# EAGLE schematic mute (EAGLE 7.2.0)
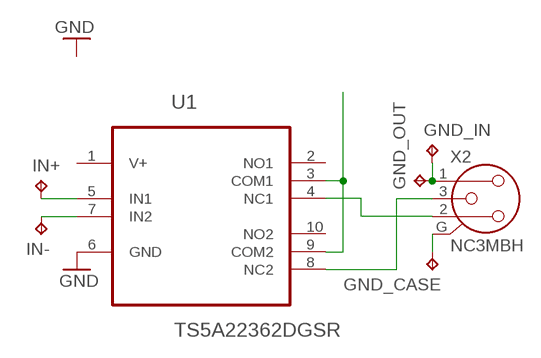
[diagram p0: schematic, sheet 1]

## Parts
GND_CASE  TPPAD1-20  [P1-20]
GND_IN  TPPAD1-20  [P1-20]
GND_OUT  TPPAD1-20  [P1-20]
IN+  TPPAD1-20  [P1-20]
IN-  TPPAD1-20  [P1-20]
U1  TS5A22362DGSR  [SOP50P490X110-10N]
X2  NC3MBH  [NC3MBH]

## Nets
GND: U1.6(GND)
N$1: IN+.TP U1.5(IN1)
N$2: IN-.TP U1.7(IN2)
N$3: GND_IN.TP GND_OUT.TP X2.1
N$4: GND_CASE.TP X2.G
N$5: U1.4(NC1) X2.2
N$6: U1.8(NC2) X2.3
N$7: U1.3(COM1) U1.9(COM2)
Unconnected: U1.2(NO1) U1.10(NO2)

## Power pins joined to a net without a drawn wire
V+: U1.1(V+)

## Library data of the parts
GND_CASE GND_IN GND_OUT IN+ IN- = testpad:TP: Test pad
U1 = Texas Instruments_By_element14_Batch_1:TS5A22362DGSR: SPDT ANALOG SWITCHES; MPN: TS5A22362DGSR; OC_FARNELL: 1755405; OC_NEWARK: 33R2198; PACKAGE: MSOP-10; SUPPLIER: Texas Instruments
X2 = con-neutrik_ag:NC3: Neutrik Audio Connector XLR SERIES Stereo 1/4" jack Source: www.neutrik.com/; MF: NEUTRIK; MPN: NC3MBH; OC_FARNELL: unknown; OC_NEWARK: 91F3470